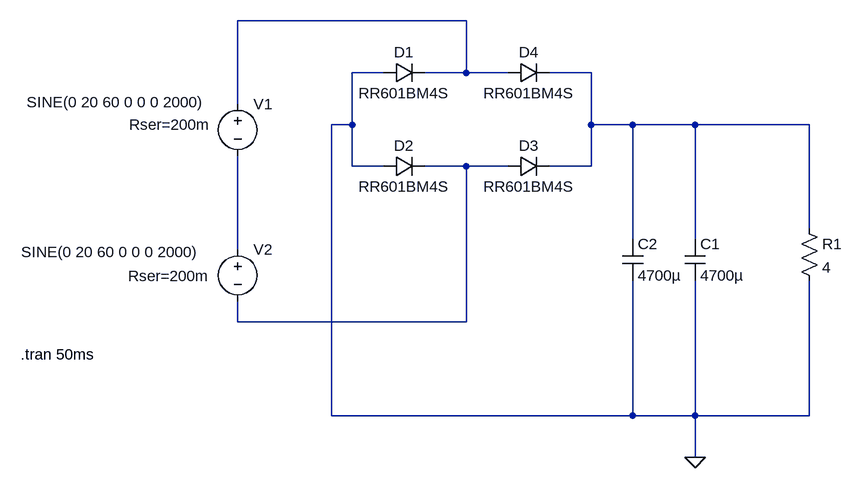
[diagram p0: schematic rectPuente.asc]
rectPuente.asc, the LTspice schematic file:
Version 4
SHEET 1 904 680
WIRE 320 -160 -32 -160
WIRE 192 -80 144 -80
WIRE 320 -80 320 -160
WIRE 320 -80 256 -80
WIRE 384 -80 320 -80
WIRE 512 -80 448 -80
WIRE -32 -32 -32 -160
WIRE 144 0 144 -80
WIRE 144 0 112 0
WIRE 512 0 512 -80
WIRE 576 0 512 0
WIRE 672 0 576 0
WIRE 848 0 672 0
WIRE 144 64 144 0
WIRE 192 64 144 64
WIRE 320 64 256 64
WIRE 384 64 320 64
WIRE 512 64 512 0
WIRE 512 64 448 64
WIRE 848 160 848 0
WIRE 576 176 576 0
WIRE 672 176 672 0
WIRE -32 192 -32 48
WIRE -32 304 -32 272
WIRE 320 304 320 64
WIRE 320 304 -32 304
WIRE 112 448 112 0
WIRE 576 448 576 240
WIRE 576 448 112 448
WIRE 672 448 672 240
WIRE 672 448 576 448
WIRE 848 448 848 240
WIRE 848 448 672 448
WIRE 672 512 672 448
FLAG 672 512 0
SYMBOL voltage -32 -48 R0
WINDOW 3 -325 13 Left 2
WINDOW 123 0 0 Left 0
WINDOW 39 -167 48 Left 2
SYMATTR InstName V1
SYMATTR Value SINE(0 20 60 0 0 0 2000)
SYMATTR SpiceLine Rser=200m
SYMBOL voltage -32 176 R0
WINDOW 3 -333 20 Left 2
WINDOW 123 0 0 Left 0
WINDOW 39 -169 57 Left 2
SYMATTR InstName V2
SYMATTR Value SINE(0 20 60 0 0 0 2000)
SYMATTR SpiceLine Rser=200m
SYMBOL diode 192 -64 R270
WINDOW 0 32 32 VTop 2
WINDOW 3 0 32 VBottom 2
SYMATTR InstName D1
SYMATTR Value RR601BM4S
SYMBOL cap 656 176 R0
SYMATTR InstName C1
SYMATTR Value 4700µ
SYMATTR SpiceLine V=50 Rser=10m Rpar=10Meg
SYMBOL res 832 144 R0
SYMATTR InstName R1
SYMATTR Value 4
SYMBOL diode 192 80 R270
WINDOW 0 32 32 VTop 2
WINDOW 3 0 32 VBottom 2
SYMATTR InstName D2
SYMATTR Value RR601BM4S
SYMBOL diode 384 80 R270
WINDOW 0 32 32 VTop 2
WINDOW 3 0 32 VBottom 2
SYMATTR InstName D3
SYMATTR Value RR601BM4S
SYMBOL diode 384 -64 R270
WINDOW 0 32 32 VTop 2
WINDOW 3 0 32 VBottom 2
SYMATTR InstName D4
SYMATTR Value RR601BM4S
SYMBOL cap 560 176 R0
SYMATTR InstName C2
SYMATTR Value 4700µ
SYMATTR SpiceLine V=50 Rser=10m Rpar=10Meg
TEXT -366 354 Left 2 !.tran 50ms

The netlist it stands for:
* rectPuente.asc
V1 N001 N004 SINE(0 20 60 0 0 0 2000) Rser=200m
V2 N004 N003 SINE(0 20 60 0 0 0 2000) Rser=200m
D1 0 N001 RR601BM4S
C1 N002 0 4700µ V=50 Rser=10m Rpar=10Meg
R1 N002 0 4
D2 0 N003 RR601BM4S
D3 N003 N002 RR601BM4S
D4 N001 N002 RR601BM4S
C2 N002 0 4700µ V=50 Rser=10m Rpar=10Meg
.model D D
.lib standard.dio
.tran 50ms
.backanno
.end